# EAGLE design WZ8048C050-V1.1-20230407 (EAGLE 9.5.1)
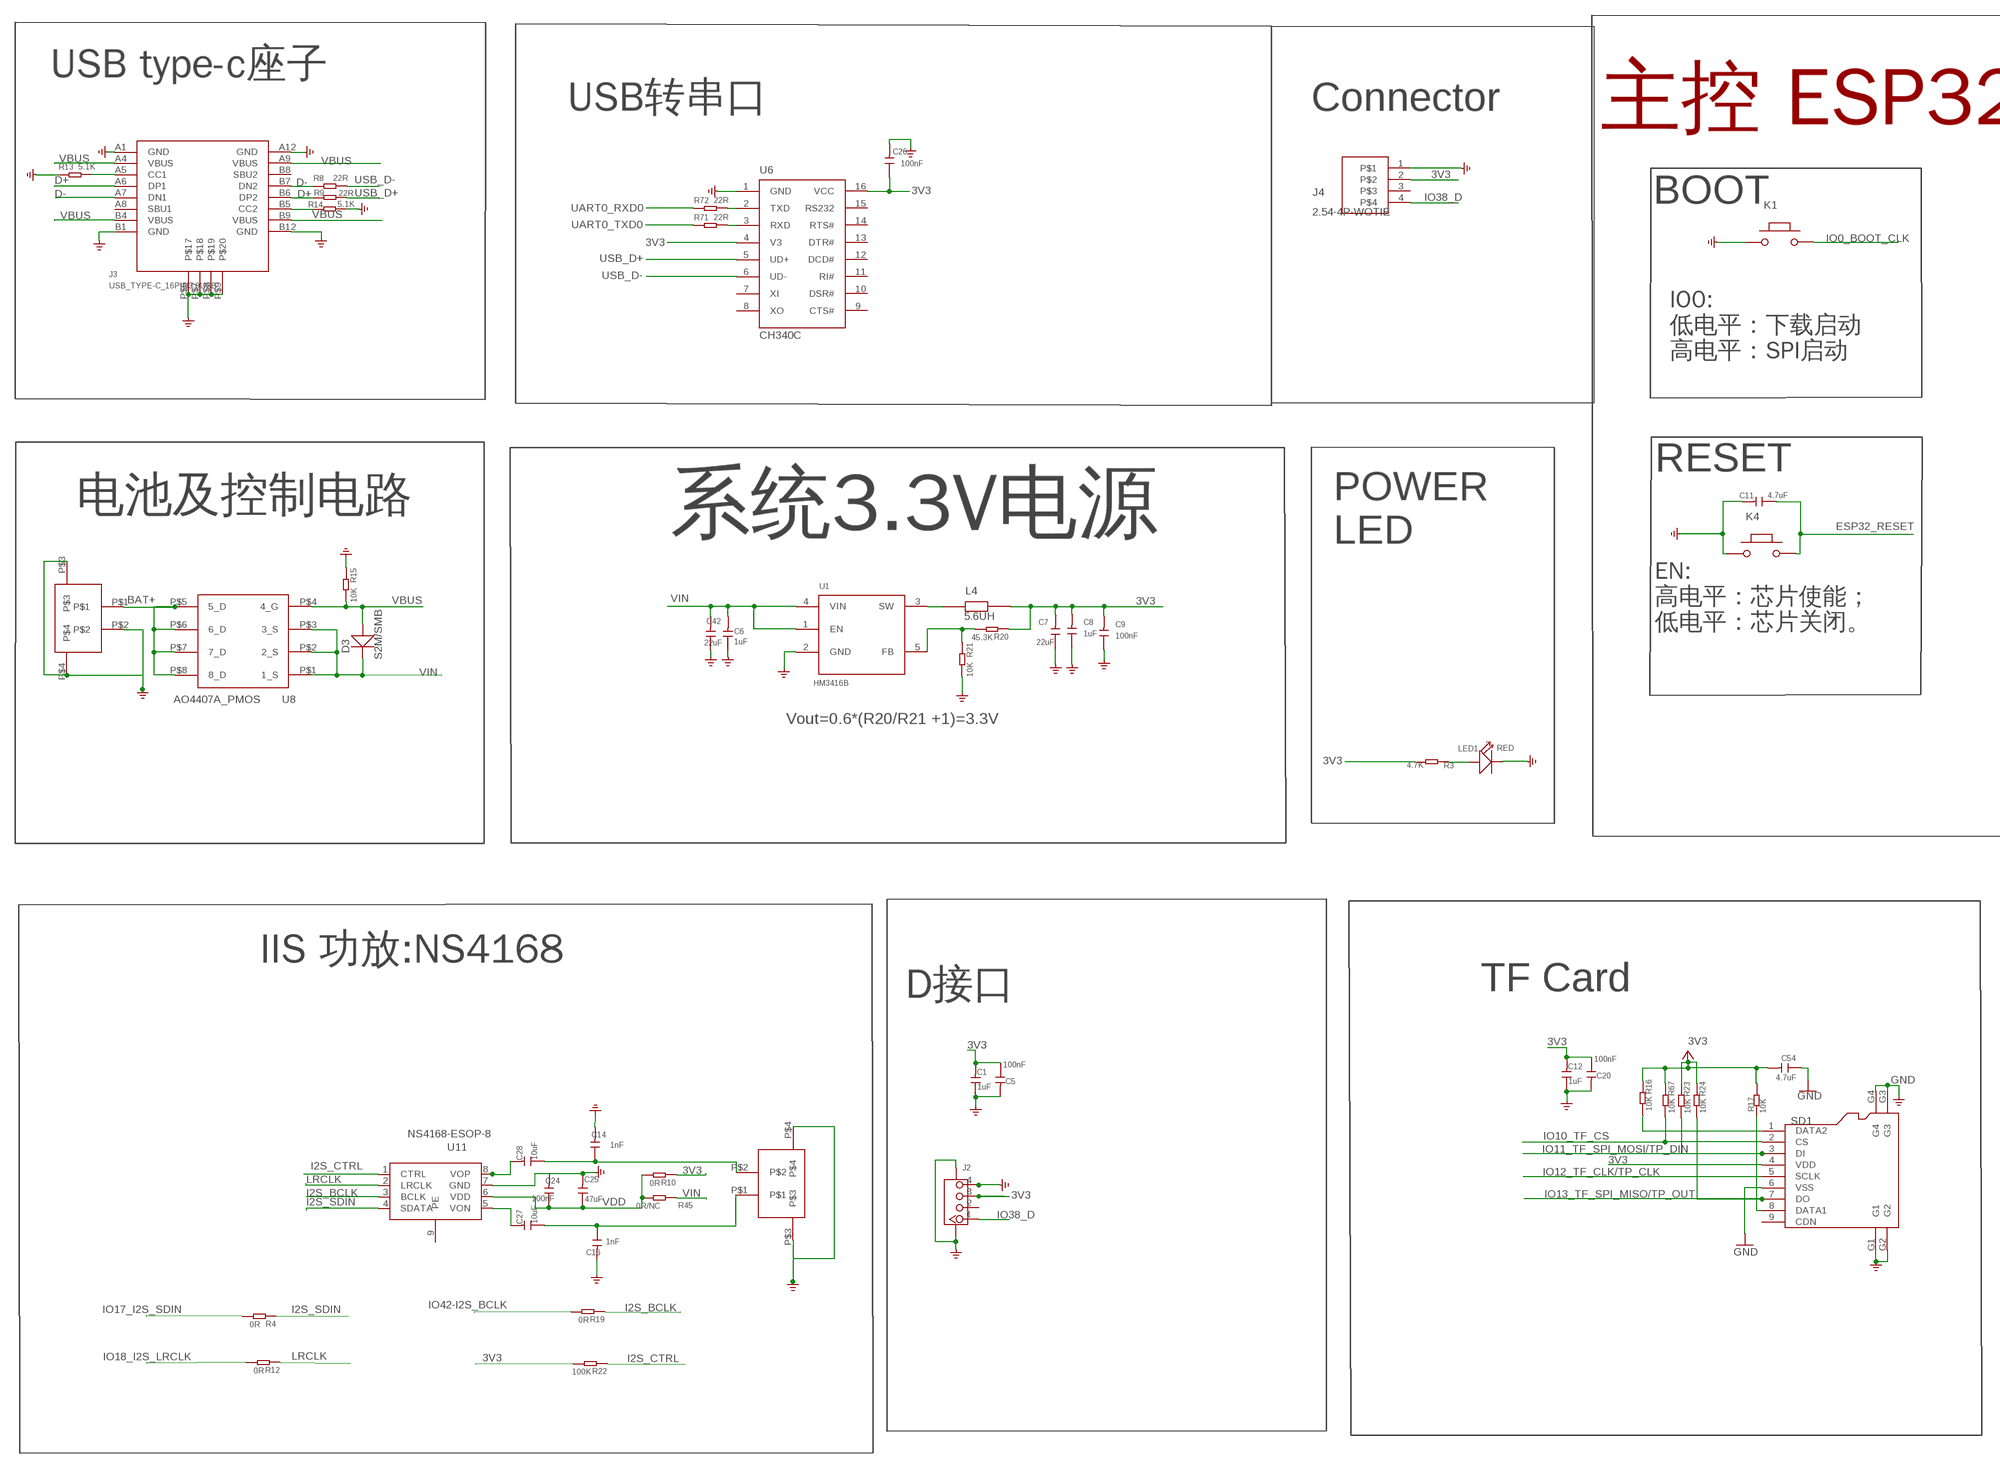
[diagram p0: schematic, sheet 1, part 1 of 2]
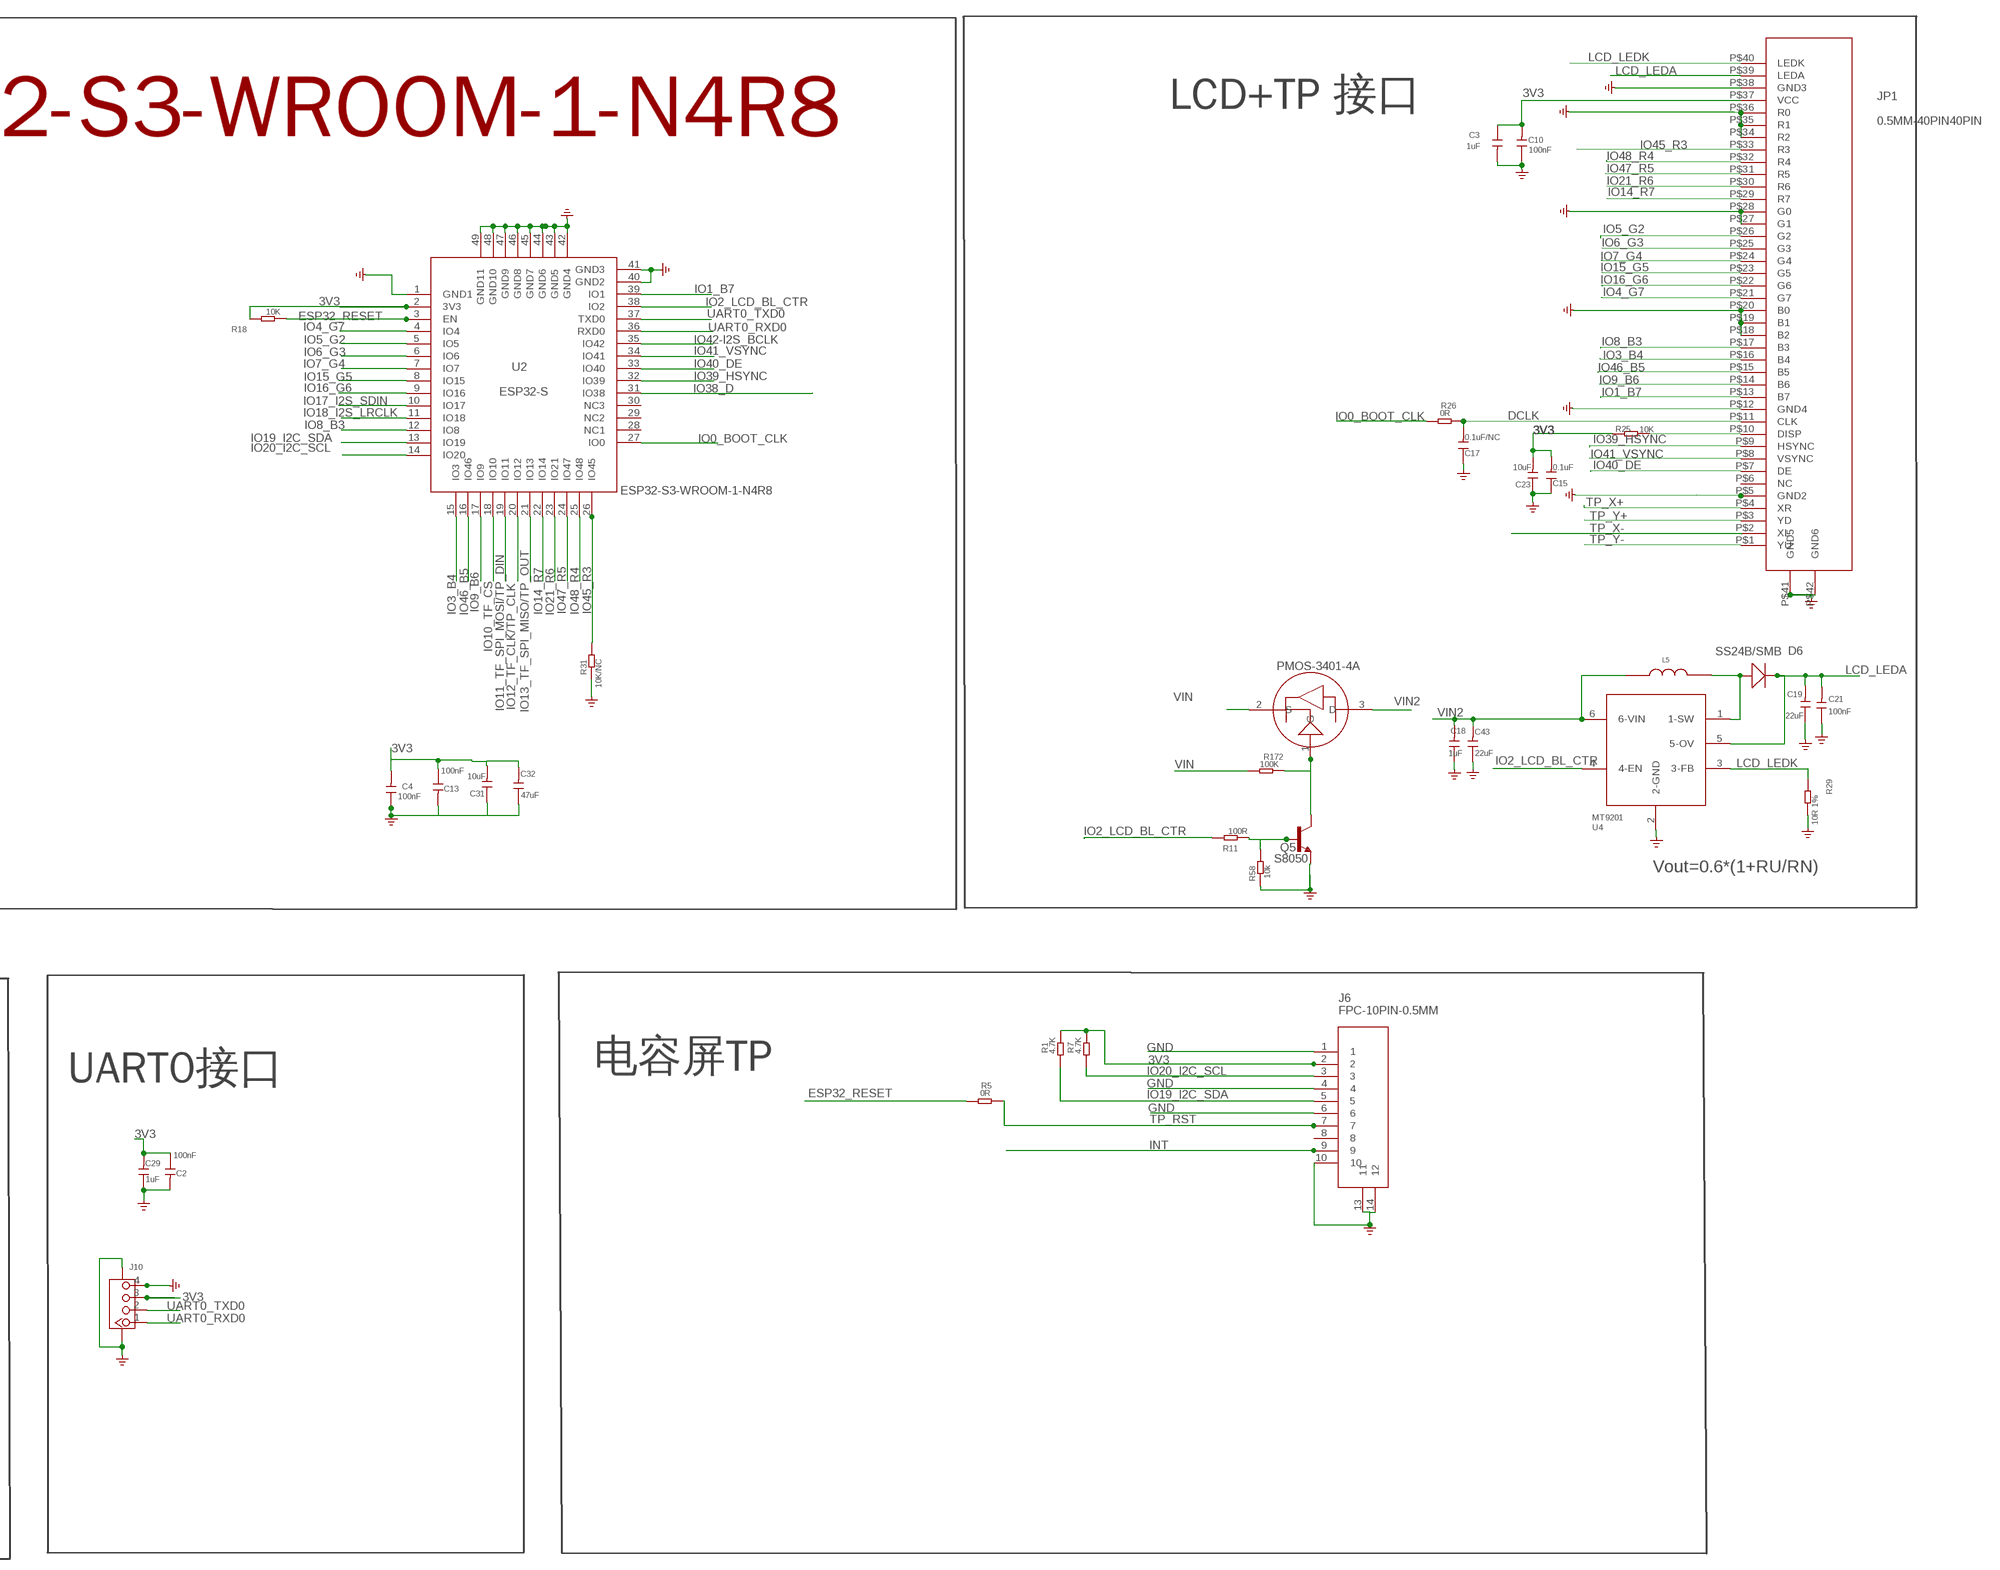
[diagram p1: schematic, sheet 1, part 2 of 2]

## Parts
C1  1uF  DISCRETE_C-0603  [DISCRETE_C0603]
C2  100nF  C-0603  [C0603]
C3  1uF  C-0603  [C0603]
C4  100nF  C-0603  [C0603]
C5  100nF  C-0603  [C0603]
C6  1uF  C0603  [0603]
C7  22uF  C0805  [0805]
C8  1uF  C0603  [0603]
C9  100nF  C0603  [0603]
C10  100nF  C-0603  [C0603]
C11  4.7uF  C0603  [0603]
C12  1uF  DISCRETE_C-0603  [DISCRETE_C0603]
C13  100nF  C-0603  [C0603]
C14  1nF  C-0603  [C0603]
C15  0.1uF  DISCRETE_C-0603  [DISCRETE_C0603]
C16  1nF  C-0603  [C0603]
C17  0.1uF/NC  DISCRETE_C-0603  [DISCRETE_C0603]
C18  1uF  C0603  [0603]
C19  22uF  C0805  [0805]
C20  100nF  C-0603  [C0603]
C21  100nF  C0603  [0603]
C23  10uF  DISCRETE_C-0603  [DISCRETE_C0603]
C24  100nF  C-0603  [C0603]
C25  47uF  C0805  [0805]
C26  100nF  C0603  [0603]
C27  10uF  DISCRETE_C-0603  [DISCRETE_C0603]
C28  10uF  DISCRETE_C-0603  [DISCRETE_C0603]
C29  1uF  DISCRETE_C-0603  [DISCRETE_C0603]
C31  10uF  DISCRETE_C-0603  [DISCRETE_C0603]
C32  47uF  C0805  [0805]
C42  22uF  C0805  [0805]
C43  22uF  C0805  [0805]
C54  4.7uF  DISCRETE_C-0603  [DISCRETE_C0603]
D3  S2M/SMB  214ABDO-214AB  [214AB]
D6  SS24B/SMB  214ABDO-214AB  [214AB]
J1  PH2.0WT-2PIN  [PH2.0WT-2PIN]
J2  CONNECTOR_TWIG-4P-2.0-SMD-FEMALE-REINFORCE90D  [CONNECTOR_4P-SMD-2.0-90D]
J3  USB_TYPE-C_16PIN3.0USB  [KEVIN_3.0TYPEC-SMD]
J4  2.54-4P-WOTIE  [2.54-4P-WOTIE]
J5  PH2.0WT-2PIN  [PH2.0WT-2PIN]
J6  FPC-10PIN-0.5MM  [FPC-10PIN-0.5MM]
J10  CONNECTOR_TWIG-4P-2.0-SMD-FEMALE-REINFORCE90D  [CONNECTOR_4P-SMD-2.0-90D]
JP1  0.5MM-40PIN40PIN  [0.5MM*40P]
K1  BUTTON  PB157  [157SW]
K4  BUTTON  PB157  [157SW]
L4  5.6UH  CROWPI2-MB-V1.4-20211012_CMP201209UD1R0MT  [CD54]
L5  CD32_6.8uH  CD32_950MA  [CD32]
LED1  RED  DISCRETE_LED0603  [DISCRETE_LED-0603]
Q5  S8050  SPARKFUN_TRANSISTOR_NPNSOT23  [SPARKFUN_SOT23]
Q30  PMOS-3401-4A  P-MOS-SOT23  [SOT-23]
R1  4.7K  R-0603  [R0603]
R3  4.7K  DISCRETE_R-0603  [DISCRETE_R0603]
R4  0R  DISCRETE_R-0603  [DISCRETE_R0603]
R5  0R  R-0603  [R0603]
R7  4.7K  R-0603  [R0603]
R8  22R  DISCRETE_R-0603  [DISCRETE_R0603]
R9  22R  DISCRETE_R-0603  [DISCRETE_R0603]
R10  0R  DISCRETE_R-0603  [DISCRETE_R0603]
R11  100R  R0603  [R0603]
R12  0R  DISCRETE_R-0603  [DISCRETE_R0603]
R13  5.1K  DISCRETE_R-0603  [DISCRETE_R0603]
R14  5.1K  DISCRETE_R-0603  [DISCRETE_R0603]
R15  10K  DISCRETE_R-0603  [DISCRETE_R0603]
R16  10K  DISCRETE_R-0603  [DISCRETE_R0603]
R17  10K  DISCRETE_R-0603  [DISCRETE_R0603]
R18  10K  DISCRETE_R-0603  [DISCRETE_R0603]
R19  0R  DISCRETE_R-0603  [DISCRETE_R0603]
R20  45.3K  DISCRETE_R-0603  [DISCRETE_R0603]
R21  10K  DISCRETE_R-0603  [DISCRETE_R0603]
R22  100K  DISCRETE_R-0603  [DISCRETE_R0603]
R23  10K  DISCRETE_R-0603  [DISCRETE_R0603]
R24  10K  DISCRETE_R-0603  [DISCRETE_R0603]
R25  10K  DISCRETE_R-0603  [DISCRETE_R0603]
R26  0R  R-0603  [R0603]
R29  10R 1%  DISCRETE_R-0603  [DISCRETE_R0603]
R31  10K/NC  R0603  [R0603]
R45  0R/NC  DISCRETE_R-0603  [DISCRETE_R0603]
R58  10k  R0603  [R0603]
R67  10K  DISCRETE_R-0603  [DISCRETE_R0603]
R71  22R  DISCRETE_R-0603  [DISCRETE_R0603]
R72  22R  DISCRETE_R-0603  [DISCRETE_R0603]
R172  100K  R-0603  [R0603]
SD1  HOLDER-MICROSD-9P  [9P-SMD-W/-RING]
U1  HM3416B  A_XBJ_HM3420B  [A_XBJ_SOT23-5]
U2  ESP32-S  [ESP32-S3]
U4  MT9201  [SOT23-6]
U6  CH340C  CH340G  [SOP-16]
U8  AO4407A_PMOS  T_PMOS_AO4407A_SOP8  [SOP8]
U11  NS4168-ESOP-8  [NS4168-ESOP-8]

## Nets
3V3: C1.2 C2.1 C3.1 C4.2 C5.1 C7.2 C8.2 C9.2 C10.2 C12.2 C13.1 C15.2 C20.1 C23.2 C26.1 C29.2 C31.2 C32.2 C54.2 J2.3 J4.2 J6.2 J10.3 JP1.P$37(VCC) L4.2 R1.2 R3.2 R7.2 R10.1 R16.1 R17.1 R18.1 R20.1 R22.2 R23.1 R24.1 R25.1 R67.1 SD1.4(VDD) U2.2(3V3) U6.4(V3) U6.16(VCC) ; supply symbol labelled +3V3
BAT+: J1.P$1 U8.P$5(5_D) U8.P$6(6_D) U8.P$7(7_D) U8.P$8(8_D)
D+: J3.A6(DP1) J3.B6(DP2) R9.1
D-: J3.A7(DN1) J3.B7(DN2) R8.1
DCLK: C17.2 JP1.P$11(CLK) R26.2
ESP32_RESET: C11.1 K4.2 R5.1 R18.2 U2.3(EN)
GND: C1.1 C2.2 C3.2 C4.1 C5.2 C6.1 C7.1 C8.1 C9.1 C10.1 C11.2 C12.1 C13.2 C14.2 C15.1 C16.2 C17.1 C18.1 C19.1 C20.2 C21.1 C23.1 C24.2 C25.2 C26.2 C29.1 C31.1 C32.1 C42.1 C43.1 C54.1 J1.P$2 J1.P$3 J1.P$4 J2.4 J2.SS1 J2.SS2 J3.A1(GND) J3.A12(GND) J3.B1(GND) J3.B12(GND) J3.P$6 J3.P$7 J3.P$8 J3.P$9 J4.1 J5.P$3 J5.P$4 J6.1 J6.4 J6.6 J6.10 J6.13 J6.14 J10.4 J10.SS1 J10.SS2 JP1.P$5(GND2) JP1.P$12(GND4) JP1.P$18(B2) JP1.P$19(B1) JP1.P$20(B0) JP1.P$27(G1) JP1.P$28(G0) JP1.P$34(R2) JP1.P$35(R1) JP1.P$36(R0) JP1.P$38(GND3) JP1.P$41(GND5) JP1.P$42(GND6) K1.1 K4.1 LED1.- Q5.2(E) R13.1 R14.2 R15.1 R21.2 R29.2 R31.1 R58.1 SD1.6(VSS) SD1.G1 SD1.G2 SD1.G3 SD1.G4 U1.2(GND) U2.1(GND1) U2.40(GND2) U2.41(GND3) U2.42(GND4) U2.43(GND5) U2.44(GND6) U2.45(GND7) U2.46(GND8) U2.47(GND9) U2.48(GND10) U2.49(GND11) U4.2(2-GND) U6.1(GND) U11.7(GND)
I2S_BCLK: R19.1 U11.3(BCLK)
I2S_CTRL: R22.1 U11.1(CTRL)
I2S_SDIN: R4.1 U11.4(SDATA)
INT: J6.9
IO0_BOOT_CLK: K1.2 R26.1 U2.27(IO0)
IO1_B7: JP1.P$13(B7) U2.39(IO1)
IO2_LCD_BL_CTR: R11.2 U2.38(IO2) U4.4(4-EN)
IO3_B4: JP1.P$16(B4) U2.15(IO3)
IO4_G7: JP1.P$21(G7) U2.4(IO4)
IO5_G2: JP1.P$26(G2) U2.5(IO5)
IO6_G3: JP1.P$25(G3) U2.6(IO6)
IO7_G4: JP1.P$24(G4) U2.7(IO7)
IO8_B3: JP1.P$17(B3) U2.12(IO8)
IO9_B6: JP1.P$14(B6) U2.17(IO9)
IO10_TF_CS: R67.2 SD1.2(CS) U2.18(IO10)
IO11_TF_SPI_MOSI/TP_DIN: R23.2 SD1.3(DI) U2.19(IO11)
IO12_TF_CLK/TP_CLK: SD1.5(SCLK) U2.20(IO12)
IO13_TF_SPI_MISO/TP_OUT: R24.2 SD1.7(DO) U2.21(IO13)
IO14_R7: JP1.P$29(R7) U2.22(IO14)
IO15_G5: JP1.P$23(G5) U2.8(IO15)
IO16_G6: JP1.P$22(G6) U2.9(IO16)
IO17_I2S_SDIN: R4.2 U2.10(IO17)
IO18_I2S_LRCLK: R12.2 U2.11(IO18)
IO19_I2C_SDA: J6.5 R1.1 U2.13(IO19)
IO20_I2C_SCL: J6.3 R7.1 U2.14(IO20)
IO21_R6: JP1.P$30(R6) U2.23(IO21)
IO38_D: J2.1 J4.4 U2.31(IO38)
IO39_HSYNC: JP1.P$9(HSYNC) U2.32(IO39)
IO40_DE: JP1.P$7(DE) U2.33(IO40)
IO41_VSYNC: JP1.P$8(VSYNC) U2.34(IO41)
IO42-I2S_BCLK: R19.2 U2.35(IO42)
IO45_R3: JP1.P$33(R3) R31.2 U2.26(IO45)
IO46_B5: JP1.P$15(B5) U2.16(IO46)
IO47_R5: JP1.P$31(R5) U2.24(IO47)
IO48_R4: JP1.P$32(R4) U2.25(IO48)
LCD_LEDA: C19.2 C21.2 D6.2(-) JP1.P$39(LEDA) U4.5(5-OV)
LCD_LEDK: JP1.P$40(LEDK) R29.1 U4.3(3-FB)
LRCLK: R12.1 U11.2(LRCLK)
N$1: LED1.+ R3.1
N$2: C27.2 U11.5(VON)
N$3: C14.1 C28.1 J5.P$2
N$7: JP1.P$10(DISP) R25.2
N$8: C28.2 U11.8(VOP)
N$11: J3.A5(CC1) R13.2
N$13: L4.1 U1.3(SW)
N$15: C16.1 C27.1 J5.P$1
N$16: D6.1(+) L5.2 U4.1(1-SW)
N$17: J3.B5(CC2) R14.1
N$20: R20.2 R21.1 U1.5(FB)
N$23: Q5.1(B) R11.1 R58.2
N$36: Q5.3(C) Q30.1(G) R172.2
N$40: R72.2 U6.2(TXD)
N$42: R71.2 U6.3(RXD)
N$47: R16.2 SD1.1(DATA2)
N$48: R17.2 SD1.8(DATA1)
TP_RST: J6.7 R5.2
TP_X+: JP1.P$4(XR)
TP_X-: JP1.P$2(XL)
TP_Y+: JP1.P$3(YD)
TP_Y-: JP1.P$1(YU)
UART0_RXD0: J10.1 R72.1 U2.36(RXD0)
UART0_TXD0: J10.2 R71.1 U2.37(TXD0)
USB_D+: R9.2 U6.5(UD+)
USB_D-: R8.2 U6.6(UD-)
VBUS: D3.1(+) J3.A4(VBUS) J3.A9(VBUS) J3.B4(VBUS) J3.B9(VBUS) R15.2 U8.P$4(4_G)
VDD: C24.1 C25.1 R10.2 R45.2 U11.6(VDD)
VIN: C6.2 C42.2 D3.2(-) Q30.2(S) R45.1 R172.1 U1.1(EN) U1.4(VIN) U8.P$1(1_S) U8.P$2(2_S) U8.P$3(3_S)
VIN2: C18.2 C43.2 L5.1 Q30.3(D) U4.6(6-VIN)
Unconnected: J2.2 J3.A8(SBU1) J3.B8(SBU2) J4.3 J6.8 JP1.P$6(NC) SD1.9(CDN) U2.28(NC1) U2.29(NC2) U2.30(NC3) U6.7(XI) U6.8(XO) U6.9(CTS#) U6.10(DSR#) U6.11(RI#) U6.12(DCD#) U6.13(DTR#) U6.14(RTS#) U6.15(RS232) U11.9(PE)

## Notes on the sheet
- USB type-c座子
- USB转串口 | Connector | LCD+TP 接口
- 主控 ESP32-S3-WROOM-1-N4R8
- BOOT
- IO0:
  低电平：下载启动
  高电平：SPI启动
- RESET
- 电池及控制电路
- 系统3.3V电源
- POWER
  LED
- EN:
  高电平：芯片使能；
  低电平：芯片关闭。
- Vout=0.6*(R20/R21 +1)=3.3V
- Vout=0.6*(1+RU/RN)
- IIS 功放:NS4168
- TF Card | UART0接口 | 电容屏TP
- D接口

## Library data of the parts
C1 C12 C27-C29 = A_xbj:DISCRETE_C*: Ceramic Capacitors
C2-C5 C10 C13 C14 C16 C20 C24 = discrete:C*: Ceramic Capacitors
C6 C8 C9 C11 C18 C21 C26 = A_xbj:C0603
C7 C19 C25 C32 C42 C43 = A_xbj:C0805
C15 C17 C23 C31 C54 = A9G:DISCRETE_C*: Ceramic Capacitors
D3 D6 = DO-214AB:214AB: 214AB
J1 J5 = cooper:PH2.0WT-2PIN
J2 J10 = A_xbj:CONNECTOR_TWIG-4P-2.0-SMD-FEMALE-REINFORCE
J3 = WZ3532R024-ESP32-V0.1-20221226:USB_TYPE-C_16PIN
J4 = cooper:2.54-4P-WOTIE
J6 = cooper:FPC-10PIN-0.5MM
JP1 = cooper:0.5MM-40PIN
K1 K4 = MySMD:PB157
L4 = CD54:CROWPI2-MB-V1.4-20211012_CMP201209UD1R0MT
L5 = CD54:CD32_950MA
LED1 = A_xbj:DISCRETE_LED*
Q5 = Adafruit_HUZZAH32_ESP32_Feather:SPARKFUN_TRANSISTOR_NPN: Transistor NPN BJT configuration in SOT23 package. MMBT2222 is the common NPN we use. Double check BCE configuration again layout.
Q30 = DFN8:P-MOS-SOT23
R1 R5 R7 R26 R172 = discrete:R*
R3 R4 R8-R10 R12-R25 R29 R45 R67 R71 R72 = Crowtail-_LED-V2.0-20190615-01:DISCRETE_R*
R11 R31 R58 = cooper:R0603
SD1 = Connector:HOLDER-MICROSD-9P
U1 = CrowBot_-V1.0-20220525:A_XBJ_HM3420B
U2 = DW1000:ESP32-S; U2: ESP32-S3-WROOM-1-N4R8
U4 = cooper:MT9201
U6 = A_xbj:CH340G
U8 = cooper:T_PMOS_AO4407A_SOP8
U11 = STC_MCUSTC8G1K08A:NS4168-ESOP-8

## Net classes
0 default: width 0.152 mm, drill 0.152 mm, clearance 0.152 mm

## Board
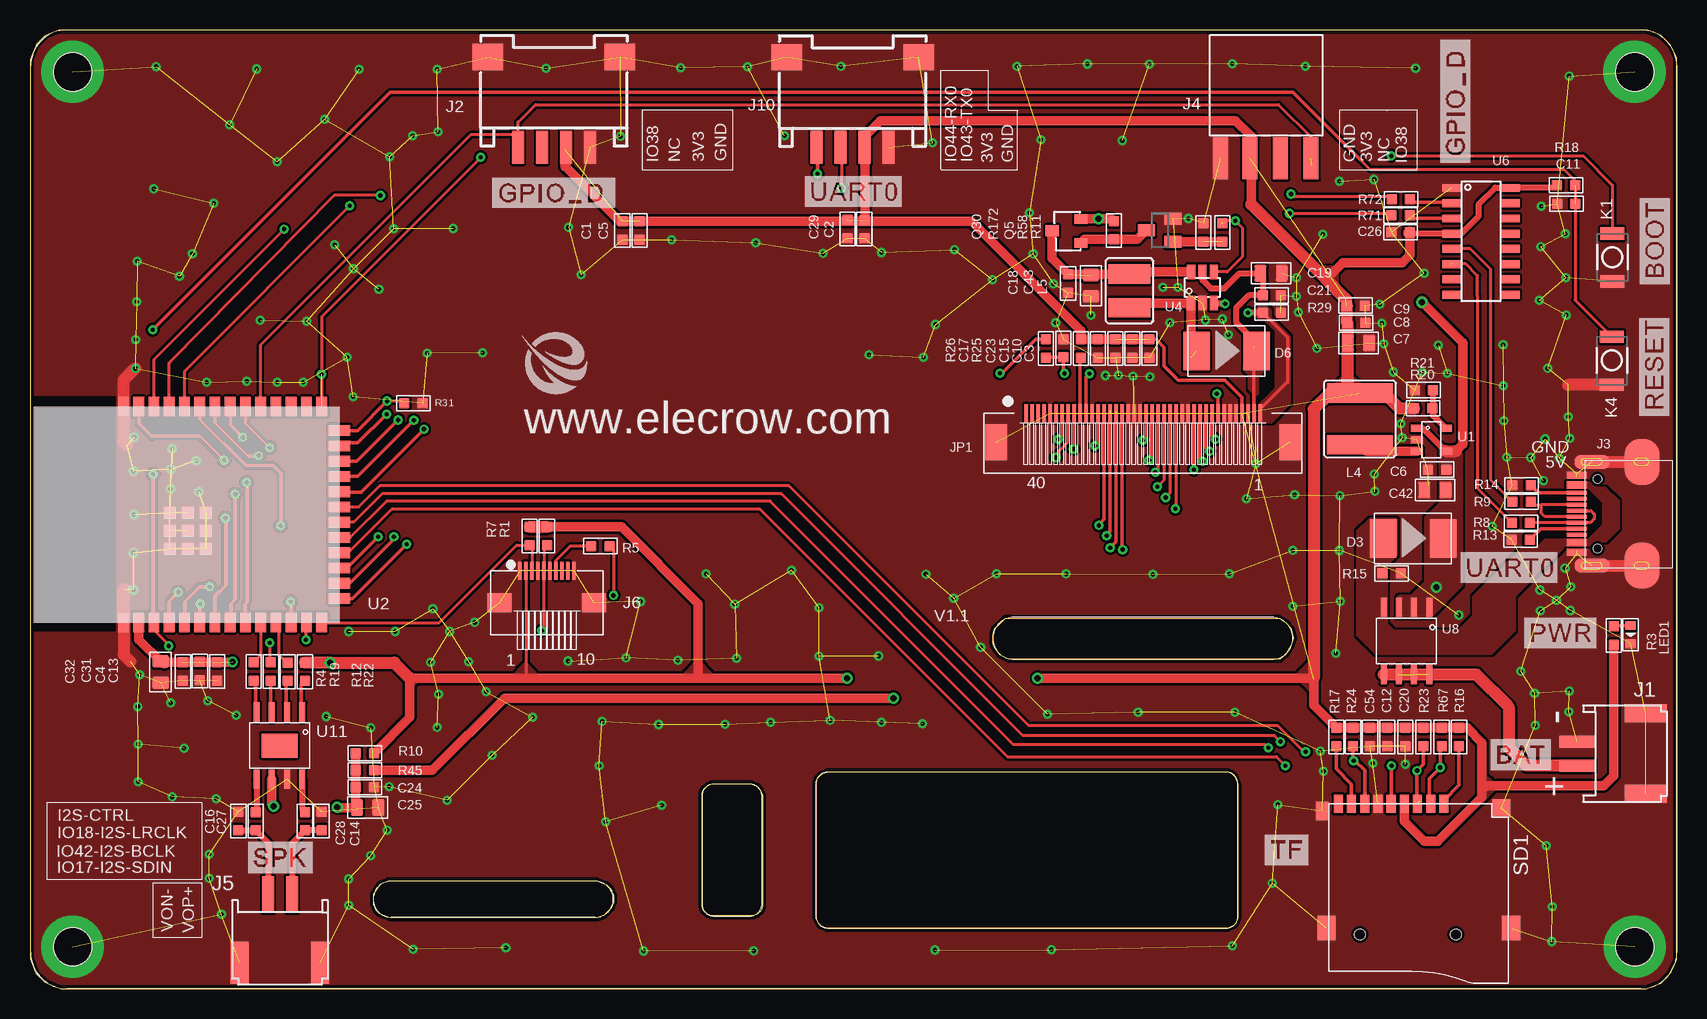
[diagram p2: board, top side]
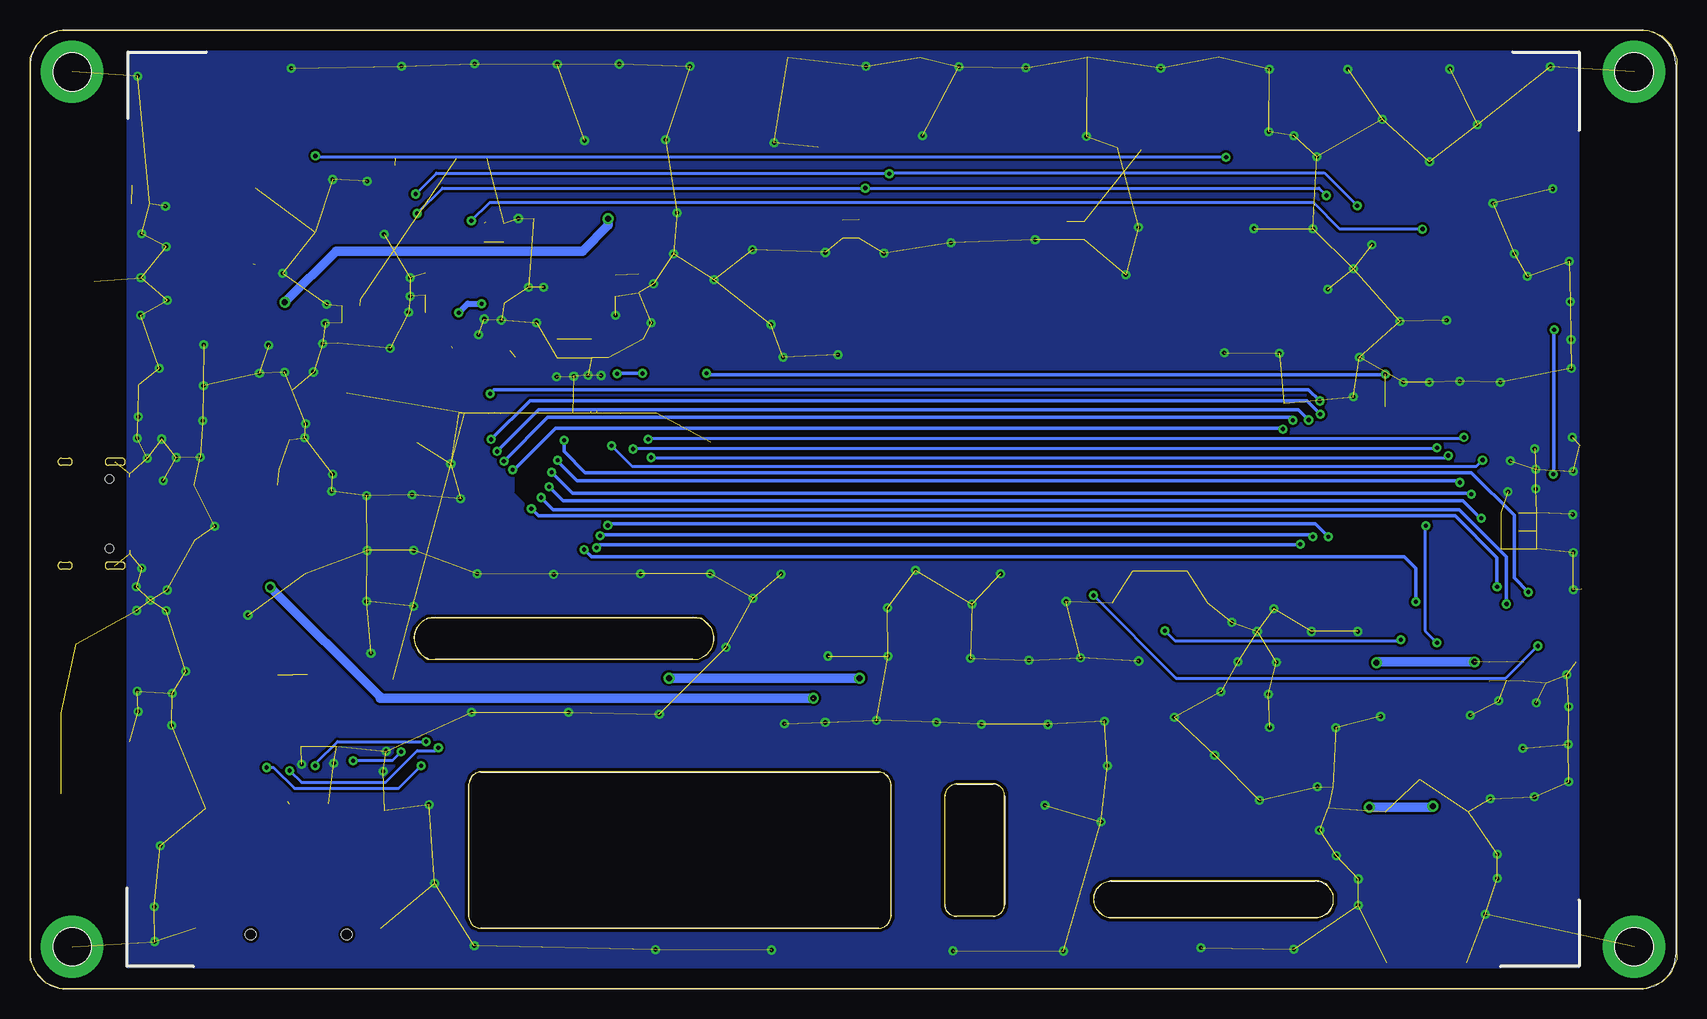
[diagram p3: board, bottom side, seen from below]

Size 137.27 x 79.91 mm. Coordinates in mm from the lower left corner, seen from the top.
Outline: 104.17,27.48 81.58,27.48 80.9,27.8 80.82,27.89 80.48,28.35 80.37,28.51 80.27,28.87 80.27,29.47 80.4,30 80.85,30.45 81.3,30.89 104.1,30.89 104.42,30.73 104.67,30.52 105.09,30.05 105.25,29.6 105.3,29.2 105.12,28.6 104.68,27.88 104.17,27.48
Outline: 134.84,79.91 2.39,79.91 1.26,79.44 0.52,78.7 0,77.45 0,2.48 0.48,1.32 1.26,0.54 2.57,0 134.74,0 135.92,0.49 136.72,1.29 137.27,2.41 137.27,77.6 136.76,78.64 135.94,79.45 134.84,79.91
Outline: 100.71,17.05 100.71,5.94 100.51,5.45 100.32,5.27 99.83,5.07 66.39,5.07 65.9,5.27 65.72,5.45 65.51,5.94 65.51,17.21 65.66,17.56 65.98,17.89 66.47,18.09 99.83,18.09 100.18,17.95 100.45,17.68 100.71,17.05
Outline: 61.06,16.12 61.06,6.87 60.92,6.52 60.62,6.22 60.27,6.08 56.81,6.08 56.47,6.22 56.16,6.52 56.02,6.87 56.02,16.29 56.16,16.64 56.47,16.94 56.81,17.08 60.1,17.08 60.59,16.88 60.86,16.61 61.06,16.12
Outline: 48.63,7.81 48.63,7.2 48.43,6.71 47.85,6.14 47.3,5.91 29.97,5.91 29.13,6.25 28.84,6.55 28.64,7.04 28.64,7.88 29.22,8.76 29.85,9.02 47.21,9.02 48.05,8.67 48.43,8.3 48.63,7.81
Copper layers (1*16): Top 0.035mm / dielectric 1.5mm / Bottom 0.035mm
Design rules "default *": minimum track width 6mil, minimum drill 0.35mm, track to track 8mil, track to pad 7mil, pad to pad 7mil, via to via 8mil, smd to smd 10mil, copper to edge 10mil, drill to drill 8mil, minimum pad ring 10mil, minimum via ring 8mil, stop-mask expansion 4mil, vias tented up to drill 100mil, thermal gap 0mil

### Footprints (pad centres in the part's own frame; a part is rotated, then mirrored left to right if it is on the bottom)
DISCRETE_C0603 = smd 0.889 x 0.889: 1 -0.762,0; 2 0.762,0
C0603 = smd 0.889 x 0.889: 1 -0.762,0; 2 0.762,0
0603 = smd 0.889 x 0.889: 1 -0.762,0; 2 0.762,0
0805 = smd 1.016 x 1.397: 1 -0.889,0; 2 0.889,0
214AB = smd 2.2 x 3.2: 1 -2.5,0; 2 2.5,0
PH2.0WT-2PIN = smd 1 x 3: P$1 -1,0; P$2 1,0 | smd 1.5 x 3.5: P$3 -3.35,-5.7; P$4 3.35,-5.7
CONNECTOR_4P-SMD-2.0-90D = smd 1.01 x 2.74: 1 -3,-0.1; 2 -1,-0.1; 3 1,-0.1; 4 3,-0.1 | smd 2.54 x 2.184: SS1 -5.5,7.4; SS2 5.5,7.4
KEVIN_3.0TYPEC-SMD = smd 0.3 x 1.7: A1 -3.35,0.5; A4 -2.55,0.5; A5 -1.25,0.5; A6 -0.25,0.5; A7 0.25,0.5; A8 1.25,0.5; A9 2.55,0.5; A12 3.35,0.5; B1 3.05,0.5; B4 2.25,0.5; B5 1.75,0.5; B6 0.75,0.5; B7 -0.75,0.5; B8 -1.75,0.5; B9 -2.25,0.5; B12 -3.05,0.5 | smd 1.143 x 2.921: P$6 -4.318,-0.762; P$7 4.318,-0.762 | smd 3.81 x 2.921: P$8 -4.318,-4.953; P$9 4.318,-4.953 | hole 0.68: -2.89,-1.22; 2.89,-1.22
2.54-4P-WOTIE = smd 1.25 x 3.5: 1 -3.759,-4.572; 2 -1.27,-4.572; 3 1.27,-4.572; 4 3.81,-4.572
FPC-10PIN-0.5MM = smd 0.3 x 1.5: 1 -2.25,2.54; 2 -1.75,2.54; 3 -1.25,2.54; 4 -0.75,2.54; 5 -0.25,2.54; 6 0.25,2.54; 7 0.75,2.54; 8 1.25,2.54; 9 1.75,2.54; 10 2.25,2.54 | smd 2 x 1.6: 13 -3.95,-0.14; 14 3.95,-0.14
0.5MM*40P = smd 0.3 x 1.5: P$1 -8.81,1.73; P$2 -8.31,1.73; P$3 -7.81,1.73; P$4 -7.31,1.73; P$5 -6.81,1.73; P$6 -6.31,1.73; P$7 -5.81,1.73; P$8 -5.31,1.73; P$9 -4.81,1.73; P$10 -4.31,1.73; P$11 -3.81,1.73; P$12 -3.31,1.73; P$13 -2.81,1.73; P$14 -2.31,1.73; P$15 -1.81,1.73; P$16 -1.31,1.73; P$17 -0.81,1.73; P$18 -0.31,1.73; P$19 0.19,1.73; P$20 0.69,1.73; P$21 1.19,1.73; P$22 1.69,1.73; P$23 2.19,1.73; P$24 2.69,1.73; P$25 3.19,1.73; P$26 3.69,1.73; P$27 4.19,1.73; P$28 4.69,1.73; P$29 5.19,1.73; P$30 5.69,1.73; P$31 6.19,1.73; P$32 6.69,1.73; P$33 7.19,1.73; P$34 7.69,1.73; P$35 8.19,1.73; P$36 8.69,1.73; P$37 9.19,1.73; P$38 9.69,1.73; P$39 10.19,1.73; P$40 10.69,1.73 | smd 1.8 x 3: P$41 -11.31,-0.67; P$42 13.19,-0.67
157SW = smd 1.016 x 1.981: 1 0,0; 2 4,0
CD54 = smd 5.5 x 1.6: 1 0,2.159; 2 0,-2.159
CD32 = smd 3.5 x 1.6: 1 0,1.409; 2 0,-1.409
DISCRETE_LED-0603 = smd 0.762 x 0.889: + -0.762,0; - 0.762,0
SPARKFUN_SOT23 = smd 1 x 1.4: 1 -0.95,-1.1; 2 0.95,-1.1; 3 0,1.1
SOT-23 = smd 1.1 x 0.8: 1 1.2,-1; 2 1.2,1 | smd 1.1 x 0.9: 3 -1.2,0
R0603 = smd 0.889 x 0.889: 1 -0.762,0; 2 0.762,0
DISCRETE_R0603 = smd 0.889 x 0.889: 1 -0.762,0; 2 0.762,0
9P-SMD-W/-RING = smd 1.524 x 0.762: 1 0,4.4; 2 0,3.3; 3 0,2.2; 4 0,1.1; 5 0,0; 6 0,-1.1; 7 0,-2.2; 8 0,-3.3; 9 0,-4.4 | smd 1.524 x 1.016: G1 0.6,-5.746 | smd 2.032 x 1.524: G2 10.373,-5.4; G3 10.373,10 | smd 1.524 x 1.524: G4 0.392,9.181 | hole 0.889: 10.9,-2.6; 10.9,5.4
A_XBJ_SOT23-5 = smd 0.6 x 1: 1 -0.95,-1.2; 2 0,-1.2; 3 0.95,-1.2; 4 0.95,1.2; 5 -0.95,1.2
ESP32-S3 = smd 1.6 x 0.9: 1 0,18.01; 2 0,16.74; 3 0,15.47; 4 0,14.2; 5 0,12.93; 6 0,11.66; 7 0,10.39; 8 0,9.12; 9 0,7.85; 10 0,6.58; 11 0,5.31; 12 0,4.04; 13 0,2.77; 14 0,1.5; 27 18,1.5; 28 18,2.77; 29 18,4.04; 30 18,5.31; 31 18,6.58; 32 18,7.85; 33 18,9.12; 34 18,10.39; 35 18,11.66; 36 18,12.93; 37 18,14.2; 38 18,15.47; 39 18,16.74; 40 18,18.01 | smd 0.9 x 1.8: 15 2,0; 16 3.28,0; 17 4.55,0; 18 5.82,0; 19 7.09,0; 20 8.36,0; 21 9.63,0; 22 10.9,0; 23 12.17,0; 24 13.44,0; 25 14.71,0; 26 16,0 | smd 1 x 1: 41 7.64,11.16; 42 9.14,11.16; 43 6.14,11.16; 44 6.14,14.16; 45 7.64,12.66; 46 9.14,12.66; 47 7.64,14.16; 48 9.14,14.16; 49 6.14,12.66
SOT23-6 = smd 0.69 x 1.2: 1 -0.95,-1.3; 2 0,-1.3; 3 0.95,-1.3; 4 0.95,1.3; 5 0,1.3; 6 -0.95,1.3
SOP-16 = smd 0.66 x 1.5: 1 -4.445,-2.475; 2 -3.175,-2.475; 3 -1.905,-2.475; 4 -0.635,-2.475; 5 0.635,-2.475; 6 1.905,-2.475; 7 3.175,-2.475; 8 4.445,-2.475; 9 4.445,2.475; 10 3.175,2.475; 11 1.905,2.475; 12 0.635,2.475; 13 -0.635,2.475; 14 -1.905,2.475; 15 -3.175,2.475; 16 -4.445,2.475
SOP8 = smd 0.5 x 1.6: P$1 -1.905,-2.8; P$2 -0.635,-2.8; P$3 0.635,-2.8; P$4 1.905,-2.8; P$5 1.905,2.8; P$6 0.635,2.8; P$7 -0.635,2.8; P$8 -1.905,2.8
NS4168-ESOP-8 = smd 1.6 x 0.5: 1 -2.8,1.905; 2 -2.8,0.635; 3 -2.8,-0.635; 4 -2.8,-1.905; 5 2.8,-1.905; 6 2.8,-0.635; 7 2.8,0.635; 8 2.8,1.905 | smd 2 x 3: 9 0,0

### Placement (x,y rotation side)
C1  49.38,63.2 90 top
C2  69.55,63.31 270 top
C3  93.32,53.37 270 top
C4  14.17,26.48 90 top
C5  50.81,63.2 270 top
C6  117.28,43.27 0 top
C7  110.74,53.82 180 top
C8  110.54,55.51 180 top
C9  110.52,56.94 180 top
C10  91.9,53.37 90 top
C11  128.07,65.42 180 top
C12  113.15,20.99 90 top
C13  15.61,26.44 270 top
C14  24.29,13.99 90 top
C15  90.47,53.37 90 top
C16  17.37,13.99 90 top
C17  86.15,53.4 270 top
C18  86.54,58.78 90 top
C19  103.45,59.63 180 top
C20  114.65,20.99 270 top
C21  103.52,57.79 180 top
C23  89.03,53.37 90 top
C24  27.91,16.8 0 top
C25  28.15,15.11 0 top
C26  114.26,63.05 180 top
C27  18.81,13.97 90 top
C28  22.92,13.97 90 top
C29  68.15,63.33 90 top
C31  12.74,26.45 90 top
C32  10.89,26.4 90 top
C42  117.11,41.58 0 top
C43  88.44,58.6 90 top
C54  111.71,20.99 90 top
D3  115.28,37.53 0 top
D6  99.74,53.16 0 top
J1  128.97,19.61 90 top
J2  43.67,70.25 0 top
J3  129.44,39.6 90 top
J4  102.98,73.78 0 top
J5  20.83,7.88 0 top
J6  43.08,32.31 0 top
J10  68.57,70.24 0 top
JP1  91.84,46.23 0 top
K1  131.9,58.95 90 top
K4  131.86,50.34 90 top
L4  110.87,47.5 180 top
L5  91.67,58.17 0 top
LED1  133.43,29.52 270 top
Q5  94.17,63.22 90 top
Q30  86.4,63.17 0 top
R1  43.08,37.74 90 top
R3  132.03,29.46 270 top
R4  18.66,26.45 90 top
R5  47.54,36.9 180 top
R7  41.66,37.74 90 top
R8  124.27,38.85 180 top
R9  124.32,40.59 180 top
R10  27.91,19.64 180 top
R11  99.41,63.04 90 top
R12  21.47,26.43 90 top
R13  124.27,37.45 0 top
R14  124.33,41.98 180 top
R15  113.51,34.62 180 top
R16  119.12,20.99 270 top
R17  108.89,20.99 270 top
R18  128.05,66.96 0 top
R19  20.08,26.45 90 top
R20  116.12,48.38 0 top
R21  116.18,49.9 180 top
R22  22.92,26.43 90 top
R23  116.15,20.99 270 top
R24  110.28,20.99 270 top
R25  87.6,53.37 270 top
R26  84.68,53.37 270 top
R29  103.52,56.36 0 top
R31  31.97,48.8 180 top
R45  27.91,18.22 180 top
R58  97.81,63.04 270 top
R67  117.68,20.99 270 top
R71  114.25,64.45 0 top
R72  114.28,65.8 0 top
R172  90.36,63.22 270 top
SD1  113.46,15.44 270 top
U1  116.81,45.76 270 top
U2  25.81,30.53 90 top
U4  97.74,58.45 0 top
U6  120.95,62.3 270 top
U8  114.74,29 180 top
U11  20.8,20.27 270 top
U$30  [ELECROW-NEW]  40.99,49.57 0 top
U$33  [5.0底框]  138.34,-0.06 0 bottom
U$41  [5.0板框]  -0.6,0.03 0 top

### Tracks (layer width: path | path; a pad name or v marks a point on that pad's centre or on a via)
0
  cutout Bottom: 93.15,46.48 96.51,46.48 96.76,46.23 96.76,41.36 95.08,39.68 95.08,41.78 93.06,43.79 93.06,46.4
3V3  (via drill 0.5)  (12 unrouted)
  Top 0.203: 109.65,56.95 C9.2 109.53,56.83 | C8.2 109.55,55.54
  Top 0.254: J6.2 41.33,25.97 41.4,25.9
  Top 0.3: 101.04,47.95 JP1.P$37 101.03,49.31 99.61,50.72 95.74,50.72 94.54,51.93 94.54,53.47 93.88,54.13 C3.1
  Top 0.5: U6.16 123.45,66.77 | C26.1 115.13,62.93 U6.4 119.32,62.93 120.75,64.36 120.75,65.37 122.15,66.77 123.45,66.77 | R18.1 127.09,66.77 123.45,66.77
  Top 0.8: C32.2 9.07,29.12 U2.2 | 93.33,54.12 C3.1 C23.2 R25.1 87.62,54.15 87.62,54.84 78.48,63.98 49.15,63.98 44.67,68.46 | SD1.4 114.56,13.96 116.23,12.29 117.34,12.29 121.04,15.99 121.04,16.58 | 44.62,69.93 44.62,68.51 44.67,68.46 | J10.3 69.61,70.17 | 69.61,70.17 69.61,64.13 C2.1 | 69.61,70.17 69.61,71.07 70.89,72.35 100.48,72.35 101.8,71.04 101.8,65.38 | 44.67,68.46 J2.3 | 107.01,25.82 107.01,23.63 R17.1 R24.1 C54.2 C12.2 C20.1 R23.1 R67.1 R16.1 119.81,21.75 121.04,20.52 121.04,16.58 | v83.99,25.9 107.01,25.9 | v68.12,25.9 55.85,25.9 | 55.85,25.9 41.4,25.9 31.66,25.9 31.66,22.63 R10.1 | R1.2 43.67,38.51 43.68,38.5 49.3,38.5 55.68,32.12 55.68,26.07 55.85,25.9 | v16.88,27.24 16.84,27.21 11.23,27.21 | 121.04,16.58 121.4,16.94 131.19,16.94 132.03,17.78 R3.2 | 108.06,59.12 109.44,60.51 114.4,60.51 115.02,61.13 C26.1
  Top 1: 11.23,27.21 11.14,27.29 C32.2 | 114.97,63 C26.1 | 31.66,25.9 30.37,27.19 v25.02,27.19 R22.2 | R7.2 R1.2 | 110.96,49.83 110.96,49.74 L4.2 | 109.71,57.47 108.06,59.12 101.8,65.38 | R20.1 114.16,48.38 112.89,49.66 L4.2 | L4.2 110.37,49.66 109.85,50.18 C7.2 109.85,55.44 C8.2 109.78,56.92 C9.2 | 107.01,25.9 107.01,48.33 108.34,49.66 L4.2
  Bottom 0.8: v83.99,25.9 v68.12,25.9 | v25.02,27.19 24.97,27.24 v16.88,27.24 | v16.88,27.24
  pour Top (no thermals): 107.09,60.26 109.02,60.26 109.02,58.24 107.09,60.17
  pour Top (no thermals): 106.67,27.33 105.41,26.07 106.84,24.64 106.84,27.41 106.76,27.41
  pour Top (no thermals): 31.49,24.72 32.42,25.65 31.49,26.57
  pour Top (no thermals): 121.12,15.57 122.38,16.83 120.95,18.26 120.95,15.48 121.04,15.48
  pour Top (no thermals): 56.94,26.24 55.68,27.5 54.26,26.07 57.03,26.07 57.03,26.15
  pour Top (no thermals): 42.58,25.98 41.32,27.24 39.89,25.82 42.66,25.82 42.66,25.9
  pour Top (no thermals): 111.12,50.26 109.86,51.52 108.44,50.09 111.21,50.09 111.21,50.18
BAT+  (2 unrouted)
  Top 1: U8.P$5 U8.P$8 120.57,26.2 123.26,23.51 123.26,20.12 124.77,18.61 J1.P$1
D+
  Top 0.254: J3.A6 126.29,39.35 125.98,39.65 125.98,40.3 | J3.B6 125.98,40.34 125.98,40.3 | 125.98,40.3 125.37,40.3 R9.1
D-
  Top 0.254: R8.1 J3.B7 130.09,38.85 130.4,39.17 130.4,39.57 130.13,39.85 J3.A7
DCLK  (via drill 0.35)  (1 unrouted)
  Top 0.3: R26.2 84.71,52.63 C17.2 86.16,51.35 v86.22,51.29 | v88.32,51.26 88.03,50.97 88.03,47.91
  Bottom 0.3: v88.32,51.26 88.3,51.29 v86.22,51.29
ESP32_RESET  (via drill 0.35)  (1 unrouted)
  Top 0.152: 131.84,54.36 K4.2
  Top 0.254: K4.2 128.81,57.39 R18.2 128.81,67.35 127.84,68.32 111.69,68.32 110.91,69.1 | U2.3 10.34,29.9 11.57,28.66 v11.57,28.58 | R5.1 48.63,36.57 v48.63,32.79
  Top 0.3: v10.28,42.89 10.28,30.59 U2.3 | v10.22,54.92 30.02,74.72 105.29,74.72 110.91,69.1
  Bottom 0.254: v48.63,32.79 41.73,25.89 14.26,25.89 v11.57,28.58
  Bottom 0.3: v10.28,42.89 10.26,42.91 10.26,54.88 v10.22,54.92
GND  (via drill 0.35, 3.2 pad 5.2)  (325 unrouted)
  Top 0.203: C42.1 116.61,41.97
  Top 1: v8.78,51.7 7.8,50.72 U2.40 7.8,45.62 8.1,45.31 | 7.9,33.3 7.8,33.2 U2.1 7.8,27.87 8.38,27.28 | J3.P$7 J3.P$9 | J3.P$6 J3.P$8 | K4.1 128.22,50.34
  other vias: 133.76,76.43 3.56,76.43 3.56,3.51 133.77,3.51 91.94,51.05 70.98,61.37 127.97,62.94 105.27,36.54 52.66,15.32 128.23,47.68 22.78,50.56 69.93,52.84 100.23,3.6 83.32,64.68 82.26,76.87 13.54,61.26 95.03,55.53 84.81,22.88 49.21,71.04 126.16,42.36 29.99,69.34 11.86,16 106.31,76.89 45.93,59.51 41.89,22.63 65.76,27.74 58.75,32.07 15.96,6.21 9.02,17.25 105.28,31.9 26.95,49.35 26.55,9.16 96.56,64.2 126.29,45.83 105.56,57.73 85.13,3.28 100.22,77.11 113.64,51.41 89.66,51.11 14.83,24.02 127.49,44.22 74.39,22.1 91.05,70.7 88.14,77.08 114.28,47.1 65.77,31.77 92.38,23.06 27.42,76.63 115.5,76.73 93.36,51.02 74.49,52.64 34.01,71.43 30.32,63.34 75.45,3.24 93.31,77.07 33.11,52.96 108.85,27.98 47.7,22.29 33.95,76.64 88.45,56.13 123.09,44.3 80.24,59.1 29.08,58.31 57.95,22.06 77,32.56 122.81,50.27 93.61,34.54 67.59,76.87 100.45,23.06 13.86,44 43.02,76.72 33.38,27.23 66.1,61.29 112.12,41.46 105.72,56.39 8.99,23.53 90.75,51.14 102.19,43.77 26.44,52.64 125.46,21.96 8.81,54.11 50.9,32.28 52.41,22.04 85.31,58.75 128.38,31.53 112.04,67.45 128.34,45.89 15.31,65.47 24.68,22.7 47.45,18.59 101.39,40.86 38.52,19.47 99.99,34.61 70.75,27.74 34.05,24.55 70.98,22.21 24.55,72.46 11.72,23.83 26.56,6.98 17.2,22.79 125.98,65.22 33.93,21.79 20.61,68.93 35.26,63.37 38.01,24.77 59.82,76.85 28.41,21.77 80.56,34.59 79.25,28.46 53.48,62.44 112.05,42.9 114.38,45.92 8.63,33.26 8.63,36.36 8.68,39.53 8.63,43.14 8.7,45.96 95.69,58.46 97.97,55.74 99.4,55.82 85.5,55.51 75.5,55.37 54.25,76.77 109.2,41.11 99.88,54.5 94.45,58.46 14.07,41.42 47.98,13.92 11.75,43.32 49.69,27.58 11.74,41.66 9.03,20.4 12.84,20.06 8.89,57.27 128.26,23.11 8.95,60.64 128.32,24.82 12.46,59.38 56.36,34.58 9.15,26.17 109.15,36.54 33.59,31.68 112.87,53.77 15.53,15.84 54,27.39 60.5,62.17 109.22,32.29 14.95,11.22 124.28,26.46 14.94,9.21 104.01,15.36 39.66,3.43 51.14,3.16 31.92,3.32 66.7,22.37 111.94,18.81 74.67,34.57 77.05,61.61 61.72,22.22 16.63,72 58.88,27.55 75.23,70.51 31.9,71.11 107.26,53.37 109.16,67.31 107.76,62.88 105.58,59.27 84.28,70.75 125.09,44.28 18.9,76.66 126.51,51.71 125.93,61.86 128.02,59.28 128.05,56.15 125.82,57.4 37.72,53.02 62.89,71.09 36.57,27.27 60.33,3.17 44.88,63.45 86.37,34.58 28.39,11.11 44.85,27.32 63.46,34.89 121.88,38.55 126.86,3.95 125.42,24.64 103.55,8.82 122.79,53.68 122.87,47.35 116.21,59.65 112.53,57.04 112.68,55.47 10.53,76.86 10.33,66.66 119.1,31.16 105.42,41.18 128.43,33.52 125.85,33.24 127.25,32.39 125.91,31.53 127.96,35.07 126.4,11.92 126.9,6.85 26.96,60.02 20.62,50.55 23.08,55.63 83.62,61.25 128.3,76.07 34.77,15.73 37.08,30.54 30.44,29.79 34.98,29.79 26.58,29.79 29.77,13.24 29.95,16.86 11.85,45.01 114.63,18.73 107.83,18.14 107.57,19.82 118.15,51.3 117.39,53.65 116.05,51.39 14.72,50.56 18.08,50.64 19.19,55.71 25.4,62.01
  pour Bottom: 8.19,78.05 129.11,78.05 129.11,1.84 8.19,1.84
  pour Top (rank 4): -0.01,79.91 137.25,79.91 137.25,-0.06 -0.09,-0.06 -0.09,29.76 7.22,29.76 7.22,49.42 -0.01,49.42
I2S_BCLK
  Top 0.3: U11.3 20.08,23.15 R19.1
I2S_CTRL
  Top 0.3: U11.1 22.62,23.15 22.62,25.36 R22.1
I2S_SDIN
  Top 0.3: U11.4 18.81,23.15 18.81,25.54 R4.1
IO0_BOOT_CLK  (via drill 0.35)  (1 unrouted)
  Top 0.254: v37.57,69.31 37.57,69.27 24.31,56.01 U2.27 24.3,48.52 | v113.48,69.41 129.48,69.41 131.9,66.99 K1.2
  Top 0.3: v80.87,51.3 81.03,51.3 83.87,54.13 R26.1
  Bottom 0.254: v113.48,69.41 113.39,69.33 37.59,69.33 v37.57,69.31
  Bottom 0.3: v80.87,51.3 80.73,51.16 24.35,51.16 v24.29,51.22
IO1_B7  (via drill 0.35)
  Top 0.254: v88.79,45.25 88.95,45.42 89.03,45.42 JP1.P$13 | U2.39 9.07,47.14 10.16,46.05 14.2,46.05 v16.19,44.07
  Bottom 0.254: v88.79,45.25 87.1,43.56 16.69,43.56 v16.19,44.07 | v16.19,44.07
IO2_LCD_BL_CTR  (via drill 0.35)  (1 unrouted)
  Top 0.254: v21.19,63.32 10.34,52.46 U2.38 | 99.3,63.9 99.4,64 v100.48,64 101.07,63.41 101.08,63.41 101.08,61.03 99.81,59.75 U4.4
  Bottom 0.254: v21.19,63.32 28.07,63.32 30.3,65.55 98.94,65.55 v100.48,64
IO3_B4  (via drill 0.35)  (1 unrouted)
  Top 0.3: 90.52,48.14 90.52,37.24 v90.04,36.76 | U2.15 26.85,32.53 v31.39,37.07
  Bottom 0.3: v90.04,36.76 89.79,37.01 31.44,37.01 v31.39,37.07
IO4_G7  (via drill 0.35)
  Top 0.254: v92.76,45.72 93.03,45.99 JP1.P$21
  Top 0.3: U2.4 11.61,32.31 v12.37,33.07
  Bottom 0.3: v12.37,33.07 13.55,34.25 13.55,39.45 17.12,43.03 91,43.03 92.76,44.79 v92.76,45.72
IO5_G2  (via drill 0.35)
  Top 0.254: JP1.P$26 95.53,40.05 v95.48,40
  Top 0.3: U2.5 12.88,32.25 14.14,33.51 v14.98,33.51
  Bottom 0.3: v14.98,33.51 14.98,35.94 18.45,39.42 94.89,39.42 v95.48,40
IO6_G3  (via drill 0.35)
  Top 0.254: JP1.P$25 95.03,41.31 v94.67,40.95
  Top 0.3: U2.6 14.15,32.03 v14.19,32.07
  Bottom 0.3: v14.19,32.07 14.19,36.02 18.11,39.94 93.66,39.94 v94.67,40.95
IO7_G4  (via drill 0.35)
  Top 0.254: JP1.P$24 94.53,42.4 v93.99,41.86
  Top 0.3: v16.29,39.22 16.29,33.59 15.42,32.72 U2.7
  Bottom 0.3: v93.99,41.86 92.81,40.68 17.84,40.68 16.38,39.22 v16.29,39.22
IO8_B3  (via drill 0.35)
  Top 0.3: v21.74,32.27 21.77,32.25 U2.12 | JP1.P$17 91.03,36.61 v91.08,36.61
  Bottom 0.3: v91.08,36.61 90.48,36 22.7,36 21.74,35.05 v21.74,32.27
IO9_B6  (via drill 0.35)  (1 unrouted)
  Top 0.3: U2.17 26.44,35.08 v29.03,37.67 | v89.1,38.62 89.1,38.71 89.52,39.12 89.52,47.94
  Bottom 0.3: v89.1,38.62 88.96,38.76 30.12,38.76 v29.03,37.67
IO10_TF_CS  (via drill 0.35)
  Top 0.254: U2.18 26.54,36.35 30.15,39.96 60.86,39.96 81.47,19.35 103.9,19.35 v104.66,18.59
  Top 0.3: SD1.2 116.63,15.56 116.63,17.53 v117.55,18.45 117.55,20.1 R67.2
  Bottom 0.254: v104.66,18.59 106.55,16.7 115.21,16.7 116.96,18.45 v117.55,18.45
IO11_TF_SPI_MOSI/TP_DIN  (via drill 0.35)  (1 unrouted)
  Top 0.254: v103.23,20.1 102.98,20.36 81.98,20.36 61.69,40.64 29.73,40.64 26.7,37.62 U2.19
  Top 0.3: R23.2 116.15,18.73 v115.62,18.19 115.62,15.88 115.85,15.65
  Bottom 0.254: v103.23,20.1 103.48,19.85 104.99,19.85 107.64,17.2 114.63,17.2 v115.62,18.19
IO12_TF_CLK/TP_CLK  (via drill 0.35)
  Top 0.254: U2.20 26.98,38.89 29.33,41.24 62.63,41.24 82.76,21.11 103.73,21.11 v104.24,20.61
  Top 0.3: SD1.5 113.49,15.47 v113.49,18.59
  Bottom 0.254: v104.24,20.61 111.63,20.61 113.49,18.74 v113.49,18.59
IO13_TF_SPI_MISO/TP_OUT  (via drill 0.35)
  Top 0.254: U2.21 27.4,40.16 29.17,41.92 63.26,41.92 83.24,21.95 103.98,21.95 106.17,19.77 v106.34,19.77
  Top 0.3: R24.2 110.28,19.02 v110.33,19.02 110.44,19.02 111.26,18.21 SD1.7
  Bottom 0.254: v106.34,19.77 107.08,19.02 v110.33,19.02
IO14_R7  (via drill 0.35)  (1 unrouted)
  Top 0.3: U2.22 25.89,41.35 26.14,41.35 26.2,41.4 27.59,41.4 v32.84,46.65 | 97.01,47.96 97.01,43.27 v97.03,43.26
  Bottom 0.3: v97.03,43.26 96.93,43.26 93.45,46.73 32.93,46.73 v32.84,46.65
IO15_G5  (via drill 0.35)
  Top 0.254: v93.8,43.07 94.03,43.07 JP1.P$23
  Top 0.3: U2.8 16.71,30.56 16.71,32.08 17.12,32.48 v17.12,41.22
  Bottom 0.3: v93.8,43.07 92.03,41.3 17.2,41.3 v17.12,41.22
IO16_G6  (via drill 0.35)
  Top 0.254: JP1.P$22 93.53,44.05 v93.29,44.05
  Top 0.3: U2.9 17.96,32.04 18.12,32.21 18.12,42.15 v18.08,42.2
  Bottom 0.3: v18.08,42.2 18.22,42.34 91.67,42.34 93.29,43.96 v93.29,44.05
IO17_I2S_SDIN
  Top 0.254: U2.10 19.23,27.79 R4.2
IO18_I2S_LRCLK
  Top 0.254: 20.83,30.19 U2.11 20.74,30.29 20.74,27.83 21.38,27.19 R12.2
IO19_I2C_SDA  (via drill 0.35)
  Top 0.254: 23.04,29.12 v23.01,29.09 23.01,30.5 U2.13 | R1.1 42.83,36.73 J6.5 42.83,30.02 v42.66,29.85
  Bottom 0.254: v23.01,29.09 23.09,29.01 41.82,29.01 v42.66,29.85
IO20_I2C_SCL
  Top 0.254: U2.14 34.11,30.53 40.56,36.98 R7.1 41.83,36.8 J6.3
IO21_R6  (via drill 0.35)  (1 unrouted)
  Top 0.3: U2.23 27.32,42.7 v32,47.38 | 97.52,47.92 97.52,44.21 v97.76,43.97
  Bottom 0.3: v97.76,43.97 94.11,47.62 32.16,47.62 32,47.46 v32,47.38
IO38_D  (1 unrouted)
  Top 0.254: U2.31 19.23,53.67 36.72,71.16 40.25,71.16 40.67,70.74 J2.1 40.67,72.22 42.15,73.7 104.07,73.7 106.84,70.92 106.84,68.66
IO39_HSYNC  (via drill 0.35)
  Top 0.254: JP1.P$9 87.03,45.02 v87,44.99 | U2.32 17.96,47.12 v19.98,45.09
  Bottom 0.254: v87,44.99 86.91,45.07 20,45.07 v19.98,45.09
IO40_DE  (via drill 0.35)
  Top 0.254: JP1.P$7 86.03,47.8 86.03,46.1 v85.73,45.8 | U2.33 16.69,47 v17.73,45.95
  Bottom 0.254: v17.73,45.95 17.82,45.87 85.66,45.87 v85.73,45.8
IO41_VSYNC  (via drill 0.35)
  Top 0.254: v85.51,44.28 85.51,44.54 86.53,45.56 JP1.P$8 | U2.34 15.42,47.16 18.13,44.45 v19.05,44.45
  Bottom 0.254: v85.51,44.28 v85.5,44.28 19.22,44.28 v19.05,44.45
IO42-I2S_BCLK  (via drill 0.35)
  Top 0.254: U2.35 14.15,47.45 17.97,43.62 20.24,43.62 20.91,42.95 v20.91,38.58 | v19.98,28.84 19.99,28.83 19.99,27.3 R19.2
  Bottom 0.254: v20.91,38.58 20.99,38.5 20.99,29.85 v19.98,28.84
IO45_R3  (via drill 0.35)  (1 unrouted)
  Top 0.254: v29.76,48.99 29.79,48.97 31.04,48.97 R31.2
  Top 0.3: U2.26 27.3,46.53 v29.76,48.99 | v98.92,49.6 99.04,49.49 99.04,47.94
  Bottom 0.3: v98.92,49.6 98.59,49.94 30.71,49.94 v29.76,48.99
IO46_B5  (via drill 0.35)  (1 unrouted)
  Top 0.3: U2.16 26.63,33.81 30.33,37.52 v30.33,37.68 | v89.75,37.75 89.75,37.83 90.02,38.11 90.02,48.17
  Bottom 0.3: v30.33,37.68 30.51,37.86 89.64,37.86 v89.75,37.75
IO47_R5  (via drill 0.35)  (1 unrouted)
  Top 0.3: v30.69,47.41 27.25,43.97 U2.24 | 98.03,47.95 98.03,45.09 v98.33,44.79
  Bottom 0.3: v98.33,44.79 94.86,48.26 31.53,48.26 v30.69,47.41
IO48_R4  (via drill 0.35)  (1 unrouted)
  Top 0.3: U2.25 26.06,45.49 27.31,45.49 v29.72,47.9 | 98.54,48.05 98.54,46.08 v98.83,45.79
  Bottom 0.3: v98.83,45.79 95.58,49.03 30.85,49.03 v29.72,47.9
LCD_LEDA  (1 unrouted)
  Top 0.3: JP1.P$39 102.03,53.2 102.03,54.06 | 102.48,53.17 102.11,53.55
  Top 0.5: 102.03,54.06 100.53,55.56 100.53,56.71 101.6,57.79 C21.2 102.76,59.44 C19.2 100.82,59.63 99.57,58.37 98.43,58.37 97.77,59.04 97.77,59.72 U4.5 | D6.2 102.02,53.38
  Top 1: D6.2 102.2,53.2 102.03,53.2
  pour Top: 101.13,51.94 103.31,51.94 102.39,51.02 102.39,49.59 102.18,49.38 101.55,50.01 101.55,51.18 101.13,51.6
LCD_LEDK  (via drill 0.35)
  Top 0.3: 102.53,48.31 104.87,50.65 | R29.1 104.87,54.25 104.87,50.57
  Top 0.5: v99.62,57.1 99.57,57.15 U4.3 | R29.1 101.54,56.36 v101.53,56.35
  Bottom 0.5: v101.53,56.35 100.77,57.1 v99.62,57.1
  pour Top: 102.39,56.9 103.14,56.9 103.48,56.56 103.48,55.97 105.08,54.38 105.08,48.75 103.48,47.15 102.56,47.15 102.39,47.32 102.39,48.66 103.82,50.09 103.82,54.8 102.81,55.8 102.39,55.8 102.22,55.97 102.22,56.73
LRCLK
  Top 0.3: U11.2 21.35,23.15 21.35,25.54 R12.1
N$1
  Top 0.3: R3.1 132.03,30.28 LED1.+
N$2
  Top 0.5: U11.5 18.89,14.82 C27.2
N$3
  Top 0.5: C14.1 22.94,13.22 C28.1 21.83,12.12 J5.P$2
N$7
  Top 0.3: JP1.P$10 87.53,52.53 R25.2
N$8
  Top 0.5: U11.8 22.7,14.96 C28.2
N$11
  Top 0.3: J3.A5 125.93,38.35 R13.2
N$13
  Top 0.8: U1.3 111.4,44.81 L4.1
N$15
  Top 0.5: C16.1 17.39,13.21 C27.1 19.83,12.18 J5.P$1
N$16  (1 unrouted)
  Top 0.8: L5.2 92.06,57.15 U4.1 96.79,52.67 96.8,52.66
N$17
  Top 0.3: J3.B5 125.73,41.34 R14.1
N$20
  Top 0.5: R21.1 116.94,48.44 117.01,48.36 R20.2 116.92,48.38 116.92,47.8 U1.5
N$23  (1 unrouted)
  Top 0.8: Q5.1 R11.1
N$36
  Top 0.8: Q30.1 87.89,62.46 R172.2 92.31,62.46 Q5.3
N$40
  Top 0.3: R72.2 115.29,65.55 118.48,65.55 U6.2
N$42
  Top 0.3: U6.3 115.27,64.2 R71.2
N$47
  Top 0.3: SD1.1 117.83,15.46 117.83,15.69 119.12,16.97 R16.2
N$48
  Top 0.3: SD1.8 110.16,17.07 108.89,18.35 R17.2
TP_RST
  Top 0.254: J6.7 43.83,35.71 45.03,36.9 R5.2
UART0_RXD0  (via drill 0.35)
  Top 0.254: U2.36 12.88,51.47 26.65,65.24 v26.64,65.25 | R72.1 113.52,66.13 113.39,66.01 105.36,66.01 v105.12,66.24
  Top 0.3: J10.1 65.64,70.07 v65.64,67.92
  Bottom 0.254: v26.64,65.25 29.39,68 65.56,68 v65.64,67.92 65.71,67.98 103.38,67.98 v105.12,66.24
UART0_TXD0  (via drill 0.35)
  Top 0.254: v29.21,66.12 25.36,66.12 11.61,52.17 U2.37 | v105,64.62 105.02,64.59 113.49,64.59 R71.1 | v67.65,66.74 67.65,70.07 J10.2
  Bottom 0.254: v29.21,66.12 29.83,66.74 v67.65,66.74 102.88,66.74 v105,64.62
USB_D+
  Top 0.254: R9.2 121.73,42.42 121.73,59.99 120.06,61.66 U6.5
USB_D-  (1 unrouted)
  Top 0.254: R8.2 120.65,41.7 120.65,57.74 120.65,59.45 119.69,60.41 118.67,60.41
VBUS
  pour Top: 126.33,37.49 129.94,37.49 131.12,38.67 131.12,40.52 129.94,41.69 128.09,41.69 128.09,42.28 130.19,42.28 130.61,41.86 131.28,41.86 132.46,40.68 132.46,38.33 131.37,37.24 130.53,37.24 130.44,37.16 130.36,37.16 130.11,36.9 128.01,36.9 123.81,32.7 123.81,29.85 121.79,27.83 112.22,27.83 110.62,29.43 110.62,38.16 111.71,39.26 113.81,39.26 113.98,39.09 113.98,36.15 113.14,35.31 113.14,30.44 113.64,29.93 119.1,29.93 120.28,31.11 120.28,32.7 124.31,36.74 125.57,36.74
VDD  (via drill 0.5)
  Top 0.8: R10.2 R45.2 C24.1 27.15,15.22 C25.1 25.65,15.11 v25.61,15.15 | v20.32,15.23 20.16,15.39 U11.6
  Bottom 0.8: v25.61,15.15 20.4,15.15 v20.32,15.23
VIN  (via drill 0.5)  (1 unrouted)
  Top 0.203: 118.16,43.02 118.01,43.17
  Top 0.5: U1.1 116.11,46.71 U1.4
  Top 0.8: Q30.2 89.05,64.17 v89.07,64.18 90.16,64.18 R172.1 | 118.86,44.81 119.44,45.39 119.44,53.84 116.02,57.26 | R45.1 33.54,18.22 39.55,24.23 v71.97,24.23
  Top 1: D3.2 117.37,37.53 | U1.4 118.86,44.81 | v116.02,57.21 116.02,57.26
  Bottom 0.8: v116.02,57.21 111.74,61.49 91.23,61.49 89.07,63.65 v89.07,64.18 | 71.99,24.22 108.1,24.22 108.1,24.33 v117.23,33.46
  pour Top: 113.9,31.02 113.98,30.94 116.75,30.94 119.44,33.63 119.44,44.55 118.77,45.22 117.42,45.22 117.42,40.43 116.25,39.26 116.25,33.88 115.16,32.79 114.15,32.79 113.9,32.54
VIN2  (1 unrouted)
  Top 0.8: U4.6 91.84,59.75 L5.1 91.63,59.54 C18.2 85.2,60.88 Q30.3

### Text on the board
tPlace: J4 | www.elecrow.com
tNames: IO38 | NC | 3V3 | GND | IO44-RX0 | IO43-TX0 | 3V3 | GND | GND | 3V3 | NC | IO38 | GND | 5V | 40 | 1 | V1.1 | 1 | 10 | - | + | I2S-CTRL | IO18-I2S-LRCLK | IO42-I2S-BCLK | IO17-I2S-SDIN | VON- | VOP+
tStop: Wizee-ESP32 | WZ8048C050